# Altium project Placa3D Gekko.PrjPcb
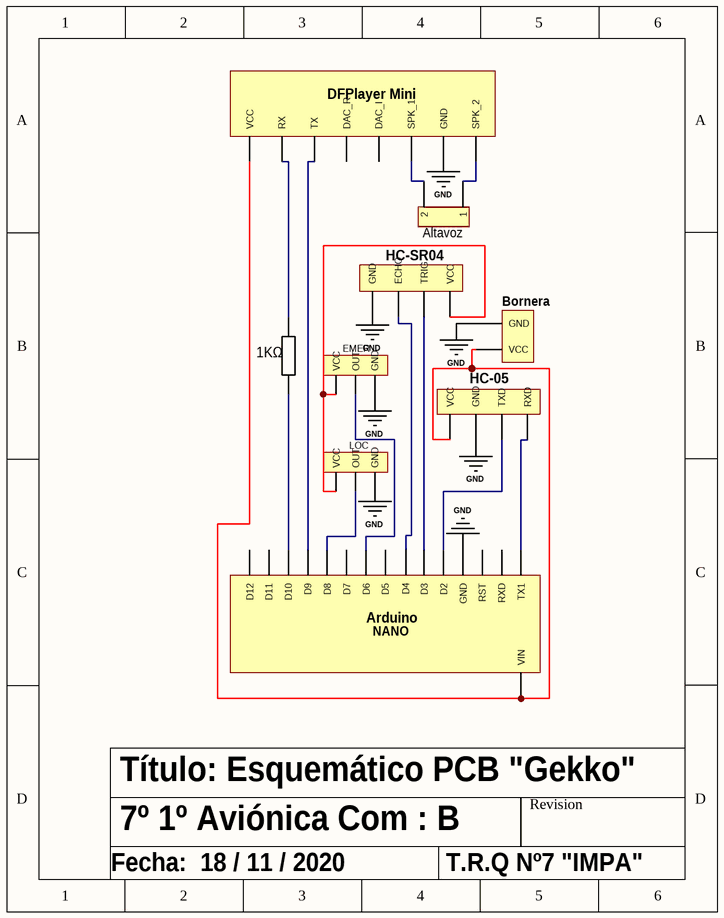
[diagram p0: Sheet1.SchDoc]
1 sheet, 9 parts. Net scope: global (net labels, ports and power ports of the same name join across sheets).
Board file: PCB1.PcbDoc

## Sheet Sheet1.SchDoc: GEKKO
size 110 x 139 mm

### Parts
1KΩ  1KR  [330RES]  (value not drawn)
Altavoz?  Altavoz  [ALTAVOZ]  (value not drawn)
Arduino_Nano?  (no value)  [Arduino NANO]
Bornera?  Bornera  [CONN2]
DFPLAYER?  DFPLAYER  [DFPLAYER]  (value not drawn)
Emer  PULS_E  [EMER]  (value not drawn)
HC-05  Bluetooth  [Bluetooth]  (value not drawn)
HC-SR04  HC-SR04  [HC-SR04]  (value not drawn)
LOC  PULS_L  [LOC]  (value not drawn)

### Nets
GND: Arduino_Nano?.?11(GND) Bornera?.2(GND) Emer.GND HC-05.?2(GND)
Net1KΩ_1: 1KΩ.1 Arduino_Nano?.?2(D10)
Net1KΩ_2: 1KΩ.2 DFPLAYER?.?7(RX)
NetAltavoz?_?1: Altavoz?.?1(1) DFPLAYER?.?1(SPK_2)
NetAltavoz?_?2: Altavoz?.?2(2) DFPLAYER?.?3(SPK_1)
NetArduino_Nano?_?1: Arduino_Nano?.?1(VIN) Bornera?.1(VCC) DFPLAYER?.?8(VCC) HC-05.?1(VCC)
NetArduino_Nano?_?3: Arduino_Nano?.?3(D9) DFPLAYER?.?6(TX)
NetArduino_Nano?_?4: Arduino_Nano?.?4(D8) LOC.OUT
NetArduino_Nano?_?6: Arduino_Nano?.?6(D6) Emer.OUT
NetArduino_Nano?_?8: Arduino_Nano?.?8(D4) HC-SR04.?3(ECHO)
NetArduino_Nano?_?9: Arduino_Nano?.?9(D3) HC-SR04.?2(TRIG)
NetArduino_Nano?_?10: Arduino_Nano?.?10(D2) HC-05.?3(TXD)
NetArduino_Nano?_?14: Arduino_Nano?.?14(TX1) HC-05.?4(RXD)
NetEmer_VCC: Emer.VCC HC-SR04.?1(VCC) LOC.VCC

Not connected (* = marked no-connect by the designer): Arduino_Nano? ?5(D7) ?7(D5) ?12(RST) ?13(RXD) ?15(D12) ?16(D11); DFPLAYER? ?2(GND) ?4(DAC_I) ?5(DAC_R); HC-SR04 ?4(GND); LOC GND

### Notes on the sheet
- 7º 1º Aviónica Com : B
- Título: Esquemático PCB "Gekko"
- Fecha:  18 / 11 / 2020
- T.R.Q Nº7 "IMPA"
- Labels drawn without touching a wire or pin: GND
- (in symbol Arduino Nano) Arduino; NANO
- (in symbol DFPLAYER) DFPlayer Mini
- (in symbol PULS_E) EMER

### Library data of the parts
1KΩ = R_1KΩ
Arduino_Nano? = Arduino Nano